# EAGLE design oc75 v5 (EAGLE 9.3.0)
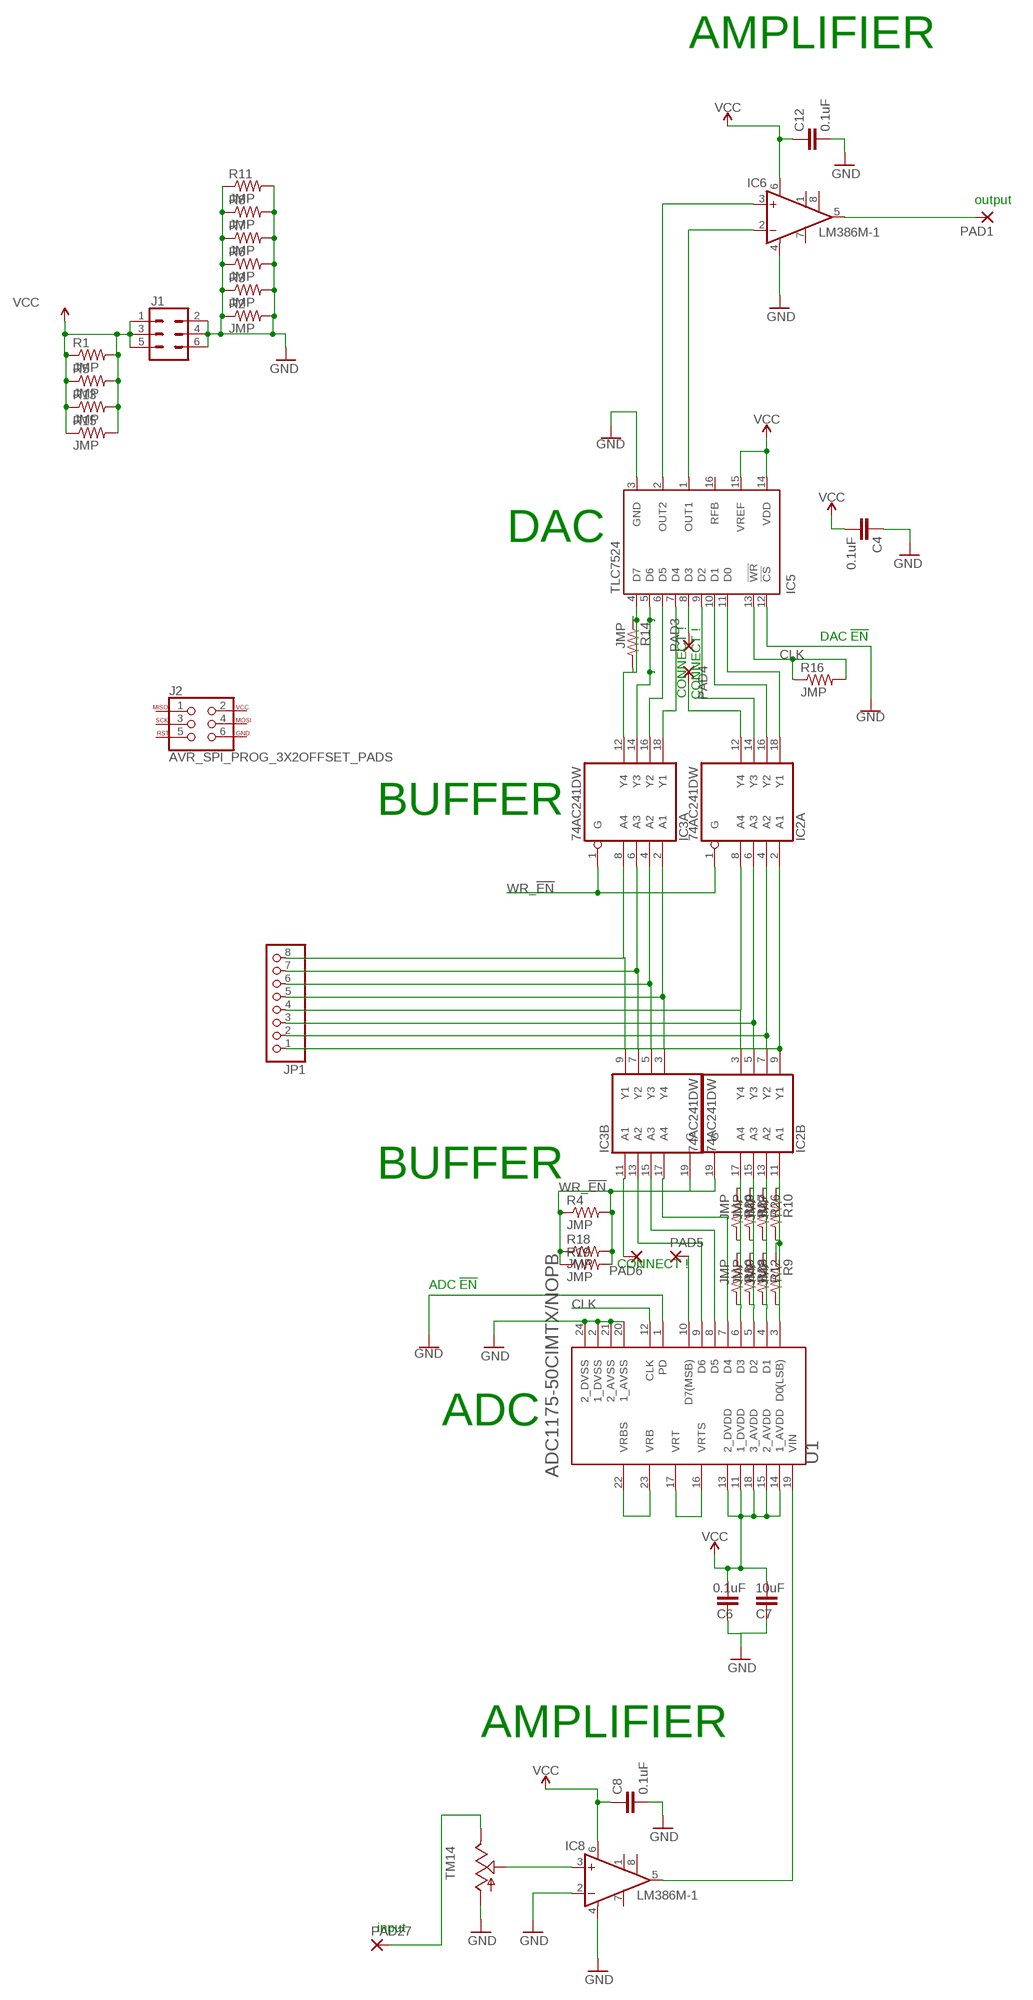
[diagram p0: schematic, sheet 1]

## Parts
C4  0.1uF  1.0UF-1206-50V-10%  [1206]
C6  0.1uF  1.0UF-1206-50V-10%  [1206]
C7  10uF  1.0UF-1206-50V-10%  [1206]
C8  0.1uF  1.0UF-1206-50V-10%  [1206]
C12  0.1uF  1.0UF-1206-50V-10%  [1206]
IC2  74AC241DW  [SO20W]
IC3  74AC241DW  [SO20W]
IC5  TLC7524  [SO16]
IC6  LM386M-1  [SO08]
IC8  LM386M-1  [SO08]
J1  CONN_03X2FEMALE_SMD  [2X3_SMD]
J2  AVR_SPI_PROG_3X2OFFSET_PADS  [2X3_OFFSET]
JP1  PINHD-1X8BIG  [1X08-BIG]
PAD1  SMD2  [SMD1,27-2,54]
PAD3  SMD2  [SMD1,27-2,54]
PAD4  SMD2  [SMD1,27-2,54]
PAD5  SMD2  [SMD1,27-2,54]
PAD6  SMD2  [SMD1,27-2,54]
PAD27  SMD2  [SMD1,27-2,54]
R1  JMP  R-US_M1206  [M1206]
R2  JMP  R-US_M1206  [M1206]
R3  JMP  R-US_M1206  [M1206]
R4  JMP  R-US_M1206  [M1206]
R5  JMP  R-US_M1206  [M1206]
R6  JMP  R-US_M1206  [M1206]
R7  JMP  R-US_M1206  [M1206]
R8  JMP  R-US_M1206  [M1206]
R9  JMP  R-US_M1206  [M1206]
R10  JMP  R-US_M1206  [M1206]
R11  JMP  R-US_M1206  [M1206]
R12  JMP  R-US_M1206  [M1206]
R13  JMP  R-US_M1206  [M1206]
R14  JMP  R-US_M1206  [M1206]
R15  JMP  R-US_M1206  [M1206]
R16  JMP  R-US_M1206  [M1206]
R18  JMP  R-US_M1206  [M1206]
R19  JMP  R-US_M1206  [M1206]
R26  JMP  R-US_M1206  [M1206]
R27  JMP  R-US_M1206  [M1206]
R28  JMP  R-US_M1206  [M1206]
R29  JMP  R-US_M1206  [M1206]
R30  JMP  R-US_M1206  [M1206]
TM14  TRIM  [6MM]
U1  TEXAS_INSTRUMENTS_ADC1175-50CIMTX-NOPBTEXAS_INSTRUMENTS_ADC1175-50CIMTX-NOPB_0_0  [TEXAS_INSTRUMENTS_ADC1175-50CIMTX-NOPB_0]

## Nets
CLK: IC5.13(!WR) R16.1 R16.2 U1.12(CLK)
GND: C4.1 C6.1 C7.1 C8.2 C12.2 IC5.3(GND) IC5.12(!CS) IC6.4(GND) IC8.2(-IN) IC8.4(GND) J1.2 J1.4 J1.6 R2.1 R2.2 R3.1 R3.2 R6.1 R6.2 R7.1 R7.2 R8.1 R8.2 R11.1 R11.2 TM14.A U1.1(PD) U1.2(1_DVSS) U1.20(1_AVSS) U1.21(2_AVSS) U1.24(2_DVSS)
N$14: IC2.2(A:A1) IC2.9(B:Y1) JP1.1
N$15: IC2.4(A:A2) IC2.7(B:Y2) JP1.2
N$16: IC2.5(B:Y3) IC2.6(A:A3) JP1.3
N$17: IC2.3(B:Y4) IC2.8(A:A4) JP1.4
N$18: IC3.2(A:A1) IC3.3(B:Y4) JP1.5
N$19: IC3.4(A:A2) IC3.5(B:Y3) JP1.6
N$20: IC3.6(A:A3) IC3.7(B:Y2) JP1.7
N$21: IC3.8(A:A4) IC3.9(B:Y1) JP1.8
N$22: IC2.18(A:Y1) IC5.11(D0)
N$23: IC2.16(A:Y2) IC5.10(D1)
N$24: IC2.14(A:Y3) IC5.9(D2)
N$25: IC2.12(A:Y4) PAD4.1(P)
N$26: IC3.18(A:Y1) IC5.7(D4)
N$27: IC3.16(A:Y2) IC5.6(D5)
N$28: IC3.14(A:Y3) IC5.5(D6)
N$29: IC3.12(A:Y4) IC5.4(D7) R14.1 R14.2
N$30: IC2.11(B:A1) R9.1 R9.2 R10.1 R10.2 U1.3(D0(LSB))
N$31: IC2.13(B:A2) R12.1 R12.2 R26.1 R26.2 U1.4(D1)
N$32: IC2.15(B:A3) R27.1 R27.2 R28.1 R28.2 U1.5(D2)
N$33: IC2.17(B:A4) R29.1 R29.2 R30.1 R30.2 U1.6(D3)
N$34: IC3.17(B:A4) U1.7(D4)
N$35: IC3.15(B:A3) U1.8(D5)
N$36: IC3.13(B:A2) U1.9(D6)
N$37: IC3.11(B:A1) PAD6.1(P)
N$38: IC5.8(D3) PAD3.1(P)
N$39: IC5.2(OUT2) IC6.3(+IN)
N$40: IC5.1(OUT1) IC6.2(-IN)
N$41: U1.16(VRTS) U1.17(VRT)
N$42: U1.22(VRBS) U1.23(VRB)
N$44: IC6.5(OUT) PAD1.1(P)
N$45: PAD5.1(P) U1.10(D7(MSB))
N$75: PAD27.1(P) TM14.E
N$99: IC8.3(+IN) TM14.S
N$100: IC8.5(OUT) U1.19(VIN)
VCC: C4.2 C6.2 C7.2 C8.1 C12.1 IC5.14(VDD) IC5.15(VREF) IC6.6(VS) IC8.6(VS) J1.1 J1.3 J1.5 R1.1 R1.2 R5.1 R5.2 R13.1 R13.2 R15.1 R15.2 U1.11(1_DVDD) U1.13(2_DVDD) U1.14(1_AVDD) U1.15(2_AVDD) U1.18(3_AVDD)
WR_!EN: IC2.1(A:G) IC2.19(B:G) IC3.1(A:G) IC3.19(B:G) R4.1 R4.2 R18.1 R18.2 R19.1 R19.2
Unconnected: IC5.16(RFB) IC6.1(GAIN) IC6.7(BYPASS) IC6.8(GAIN) IC8.1(GAIN) IC8.7(BYPASS) IC8.8(GAIN) J2.1 J2.2 J2.3 J2.4 J2.5 J2.6

## Notes on the sheet
- AMPLIFIER
- output
- DAC
- DAC !EN
- CONNECT ! | CONNECT !
- BUFFER
- BUFFER
- CONNECT !
- ADC !EN
- ADC
- AMPLIFIER
- input

## Power pins joined to a net without a drawn wire
GND: IC2.10(P:GND) IC3.10(P:GND)
VCC: IC2.20(P:VCC) IC3.20(P:VCC)

## Library data of the parts
C4 C6-C8 C12 = SparkFun-Capacitors:1.0UF: 1µF ceramic capacitors A capacitor is a passive two-terminal electrical component used to store electrical energy temporarily in an electric field.; PROD_ID: CAP-09822; VALUE: 1.0uF
IC2 IC3 = 74xx-eu:74*241: Octal BUFFER and LINE DRIVER, 3-state
IC5 = tlc7524:TLC7524: 8-Bit Buffered Multiplying DAC Source: http://www.analog.com/UploadedFiles/Data_Sheets/888358036ad7524.pdf
IC6 IC8 = linear:LM386?-*: Low Voltage Audio Power Amplifier Source: http://cache.national.com/ds/LM/LM386.pdf
J1 = SparkFun-Connectors:CONN_03X2: Multi connection point. Often used as Generic Header-pin footprint for 0.1 inch spaced/style header connections You can populate with any combo of single row headers, but if you'd like an exact match, check these: Header - 2x3 (Male, 0.1") <https://www.sparkfun.com/products/12807> (PRT-12807) Header - 2x3 (Female, 0.1") <https://www.sparkfun.com/products/13010> (PRT-13010) 2x3 Pin Shrouded Header <https://www.sparkfun.com/products/10877> (PRT-10877) On any of the 0.1 inch spaced packages, you can populate with these: Break Away Headers - Straight <https://www.sparkfun.com/products/116> (PRT-00116) Break Away Male Headers - Right Angle <https://www.sparkfun.com/products/553> (PRT-00553) Female Headers <https://www.sparkfun.com/products/115> (PRT-00115) Break Away Headers - Machine Pin <https://www.sparkfun.com/products/117> (PRT-00117) Break Away Female Headers - Swiss Machine Pin <https://www.sparkfun.com/products/743> (PRT-00743) Special note: the shrouded connector mates well with our 3x2 ribbon cables: Ribbon Crimp Connector - 6-pin (2x3, Female) <https://www.sparkfun.com/products/10651> (PRT-10651) Ribbon Cable - 6 wire (15ft) <https://www.sparkfun.com/products/10646> (PRT-10646); PROD_ID: CONN-11290
J2 = SparkFun-Connectors:AVR_SPI_PROG_3X2: AVR ISP 6 Pin This is the reduced ISP connector for AVR programming. Common on Arduino. This footprint will take up less PCB space and can be used with a 10-pin to 6-pin adapter such as SKU: BOB-08508 **Special note about "TEST_POINT" package. The stop mask is on the top side, so if you want your programming test points to be on the bottom of your board, make sure to place this package on the bottom side of the board. This also ensure that the orientation to program from the bottom side will be correct. SparkFun Products: SparkFun ISP Pogo Adapter <https://www.sparkfun.com/products/11591> - NS Tiny AVR Programmer <https://www.sparkfun.com/products/11801> -PTH
JP1 = adafruit:PINHD-1X8: PIN HEADER
PAD1 PAD3-PAD6 PAD27 = wirepad:SMD2: SMD PAD
R1-R16 R18 R19 R26-R30 = adafruit:R-US_: RESISTOR, American symbol
TM14 = adafruit:TRIM
U1 = NOPB:TEXAS_INSTRUMENTS_ADC1175-50CIMTX-NOPB: IC ADC 8BIT 24-TSSOP; CENTROID_NOT_SPECIFIED: No; DATASHEET: http://www.ti.com/lit/ds/symlink/adc1175-50.pdf; DIGIKEY_DESCRIPTION: IC ADC 8BIT 24-TSSOP; DIGIKEY_PART_NUMBER: 296-36905-1-ND; IPC_LAND_PATTERN_NAME: CAPC6030X23; LEAD_FREE: yes; MF: Texas Instruments; MFG_PACKAGE_IDENT: PW0024A; MFG_PACKAGE_IDENT_DATE: 0; MFG_PACKAGE_IDENT_REV: 0; MOUSER_DESCRIPTION: Analog to Digital Converters - ADC; MOUSER_PART_NUMBER: 926-AD117550CIMTXNPB; MPN: ADC1175-50CIMTX/NOPB; PACKAGE: TSSOP-24; PREFIX: U; ROHS: yes; TEMPERATURE_RANGE_HIGH: +75°C; TEMPERATURE_RANGE_LOW: -20°C

## Board
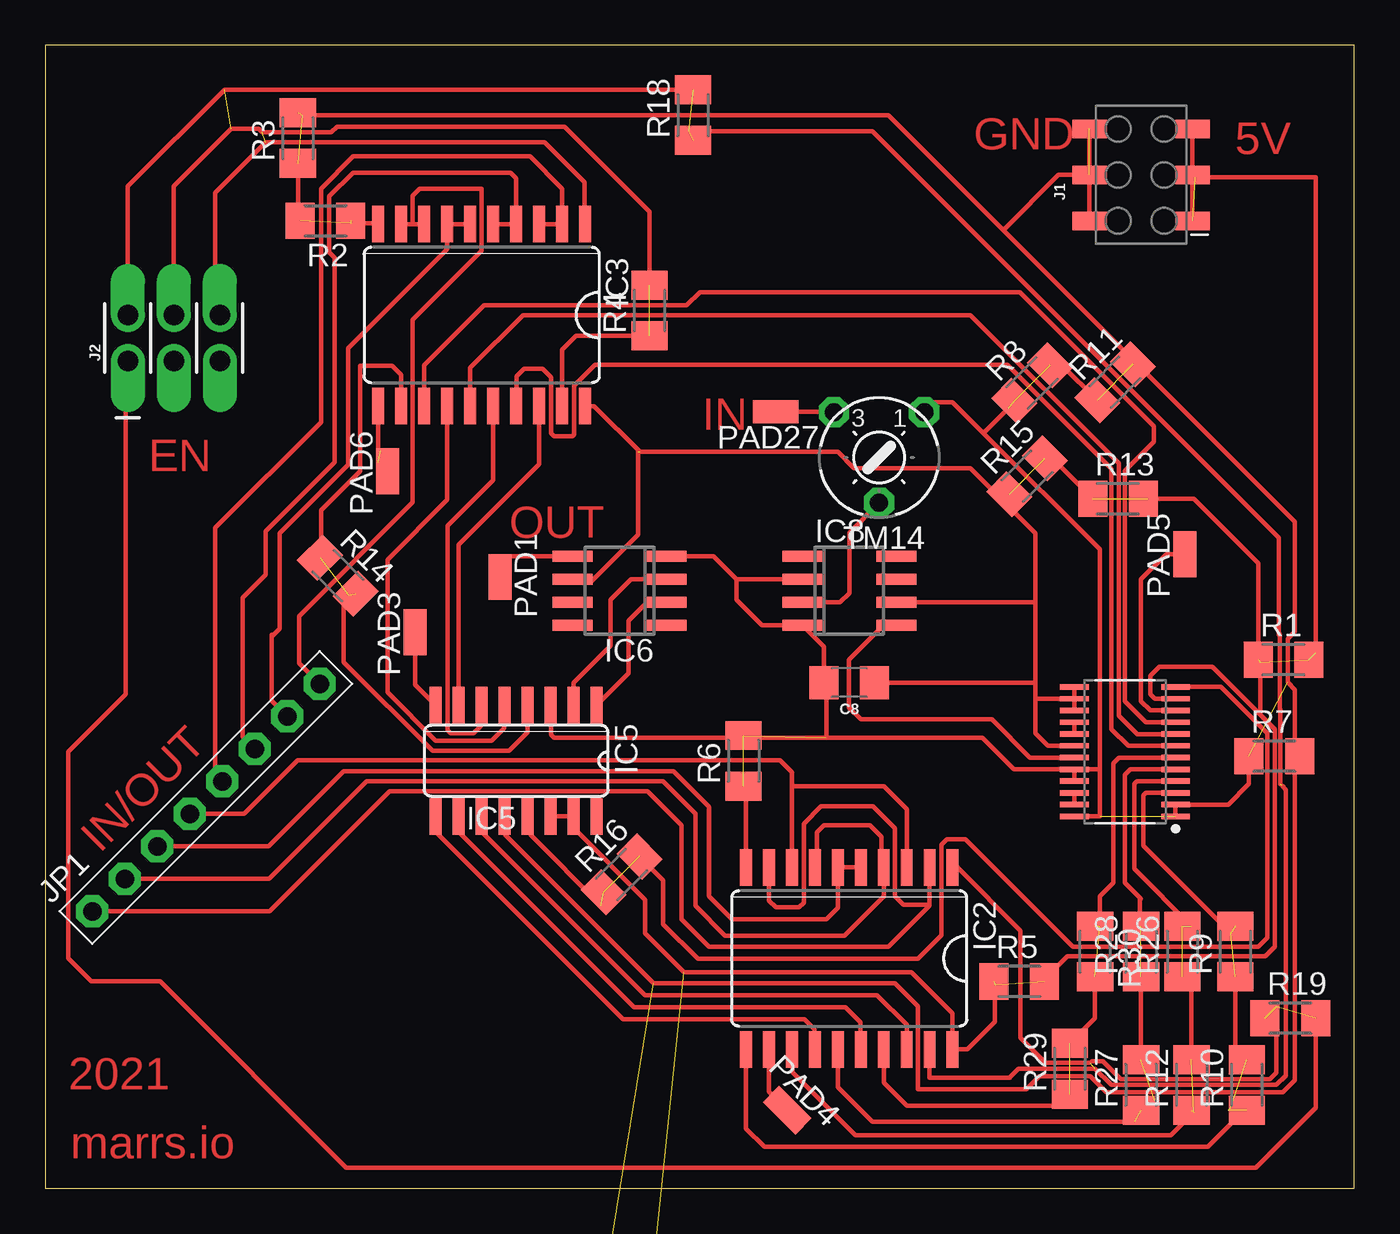
[diagram p1: board, top side]
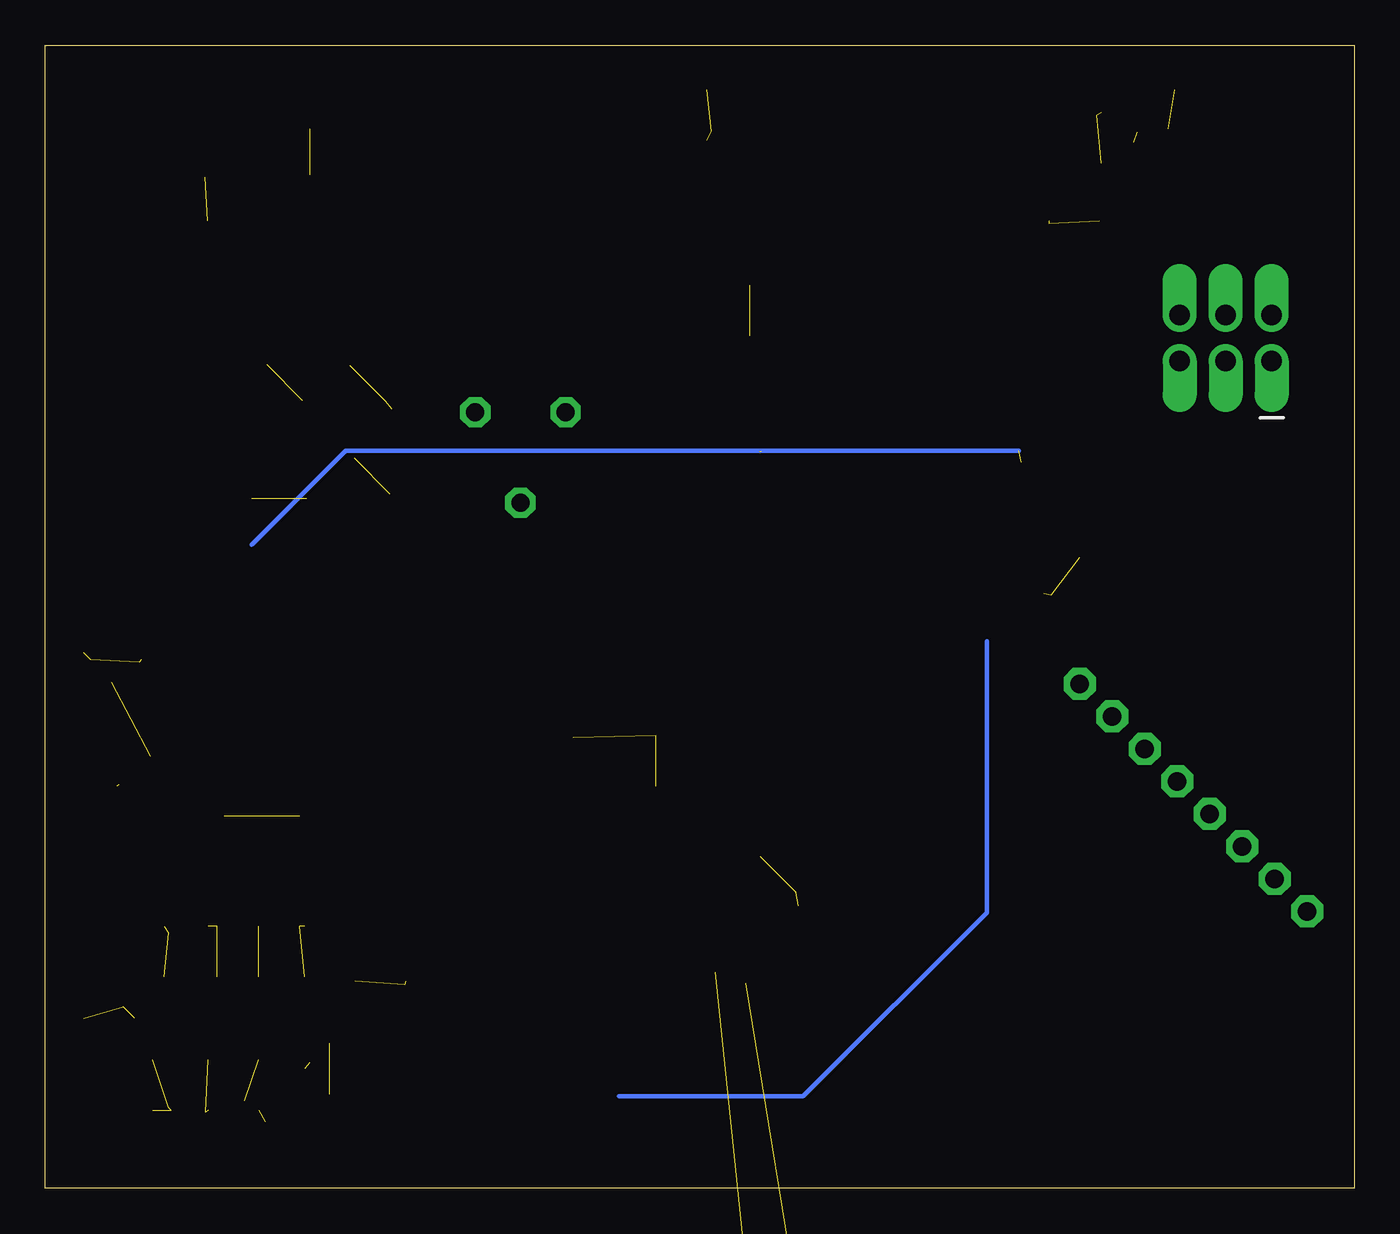
[diagram p2: board, bottom side, seen from below]

Size 72.37 x 63.17 mm. Coordinates in mm from the lower left corner, seen from the top.
Outline: 0,0 72.37,0 72.37,63.17 0,63.17 0,0
Copper layers (1*16): Top 0.035mm / dielectric 1.5mm / Bottom 0.035mm
Design rules "default *": minimum track width 10mil, minimum drill 0.35mm, track to track 6mil, track to pad 6mil, pad to pad 6mil, via to via 6mil, smd to smd 6mil, copper to edge 40mil, drill to drill 6mil, minimum pad ring 10mil, minimum via ring 8mil, stop-mask expansion 4mil, vias tented up to drill 0mil, thermal gap 10mil

### Footprints (pad centres in the part's own frame; a part is rotated, then mirrored left to right if it is on the bottom)
1206 = smd 1.6 x 1.8: 1 -1.4,0; 2 1.4,0
SO20W = smd 0.66 x 2.032: 1 -5.715,-5.029; 2 -4.445,-5.029; 3 -3.175,-5.029; 4 -1.905,-5.029; 5 -0.635,-5.029; 6 0.635,-5.029; 7 1.905,-5.029; 8 3.175,-5.029; 9 4.445,-5.029; 10 5.715,-5.029; 11 5.715,5.029; 12 4.445,5.029; 13 3.175,5.029; 14 1.905,5.029; 15 0.635,5.029; 16 -0.635,5.029; 17 -1.905,5.029; 18 -3.175,5.029; 19 -4.445,5.029; 20 -5.715,5.029
SO16 = smd 0.66 x 2.032: 1 -4.445,-3.073; 2 -3.175,-3.073; 3 -1.905,-3.073; 4 -0.635,-3.073; 5 0.635,-3.073; 6 1.905,-3.073; 7 3.175,-3.073; 8 4.445,-3.073; 9 4.445,3.073; 10 3.175,3.073; 11 1.905,3.073; 12 0.635,3.073; 13 -0.635,3.073; 14 -1.905,3.073; 15 -3.175,3.073; 16 -4.445,3.073
SO08 = smd 0.6 x 2.2: 1 -1.905,-2.6; 2 -0.635,-2.6; 3 0.635,-2.6; 4 1.905,-2.6; 5 1.905,2.6; 6 0.635,2.6; 7 -0.635,2.6; 8 -1.905,2.6
2X3_SMD = smd 1.02 x 1.9: 1 -2.54,-2.85; 2 -2.54,2.85; 3 0,-2.85; 4 0,2.85; 5 2.54,-2.85; 6 2.54,2.85
2X3_OFFSET = drill 1.118 pad 1.88 offset: 1 -2.54,-1.27; 2 -2.54,1.27; 3 0,-1.27; 4 0,1.27; 5 2.54,-1.27; 6 2.54,1.27
1X08-BIG = drill 1.016 pad 1.778 octagon: 1 -8.89,0; 2 -6.35,0; 3 -3.81,0; 4 -1.27,0; 5 1.27,0; 6 3.81,0; 7 6.35,0; 8 8.89,0
SMD1,27-2,54 = smd 1.27 x 2.54: 1 0,0
M1206 = smd 1.6 x 2: 1 -1.4,0; 2 1.4,0
6MM = drill 1 pad 1.676 octagon: A -2.5,-2.5; E 2.5,-2.5; S 0,2.5
TEXAS_INSTRUMENTS_ADC1175-50CIMTX-NOPB_0 = smd 0.3 x 1.6: 1 -3.575,-2.8; 2 -2.925,-2.8; 3 -2.275,-2.8; 4 -1.625,-2.8; 5 -0.975,-2.8; 6 -0.325,-2.8; 7 0.325,-2.8; 8 0.975,-2.8; 9 1.625,-2.8; 10 2.275,-2.8; 11 2.925,-2.8; 12 3.575,-2.8; 13 3.575,2.8; 14 2.925,2.8; 15 2.275,2.8; 16 1.625,2.8; 17 0.975,2.8; 18 0.325,2.8; 19 -0.325,2.8; 20 -0.975,2.8; 21 -1.625,2.8; 22 -2.275,2.8; 23 -2.925,2.8; 24 -3.575,2.8 | smd 0.25 x 1.55: SMD_25 3.575,2.8; SMD_26 2.925,2.8; SMD_27 2.275,2.8; SMD_28 1.625,2.8; SMD_29 0.975,2.8; SMD_30 0.325,2.8; SMD_31 -0.325,2.8; SMD_32 -0.975,2.8; SMD_33 -1.625,2.8; SMD_34 -2.275,2.8; SMD_35 -2.925,2.8; SMD_36 -3.575,2.8; SMD_37 -3.575,-2.8; SMD_38 -2.925,-2.8; SMD_39 -2.275,-2.8; SMD_40 -1.625,-2.8; SMD_41 -0.975,-2.8; SMD_42 -0.325,-2.8; SMD_43 0.325,-2.8; SMD_44 0.975,-2.8; SMD_45 1.625,-2.8; SMD_46 2.275,-2.8; SMD_47 2.925,-2.8; SMD_48 3.575,-2.8

### Placement (x,y rotation side)
C4  -48.26,-50.8 0 top  (outside the outline)
C6  31.75,-8.89 0 top  (outside the outline)
C7  -2.54,-24.13 0 top  (outside the outline)
C8  44.45,27.94 180 top
C12  -35.56,-58.42 0 top  (outside the outline)
IC2  44.45,12.7 180 top
IC3  24.13,48.26 180 top
IC5  26.04,23.62 180 top
IC6  31.75,33.02 90 top
IC8  44.45,33.02 270 top
J1  60.58,56.01 90 top
J2  7.11,46.99 0 top
JP1  8.89,21.59 45 top
PAD1  25.15,33.78 180 top
PAD3  20.45,30.73 0 top
PAD4  41.02,4.32 225 top
PAD5  62.99,35.05 0 top
PAD6  18.92,39.62 0 top
PAD27  40.39,42.93 90 top
R1  68.45,29.21 0 top
R2  15.49,53.47 180 top
R3  13.97,58.04 90 top
R4  33.4,48.51 90 top
R5  53.85,11.43 0 top
R6  38.61,23.62 90 top
R7  67.94,23.88 0 top
R8  54.56,44.5 45 top
R9  65.79,13.08 90 top
R10  66.42,5.71 90 top
R11  59.14,44.54 45 top
R12  63.37,5.71 90 top
R13  59.31,38.1 0 top
R14  16.18,33.85 315 top
R15  54.28,39.35 45 top
R16  31.86,17.35 45 top
R18  35.81,59.31 90 top
R19  68.83,9.4 0 top
R26  62.86,13.08 90 top
R27  60.58,5.71 90 top
R28  60.58,13.08 90 top
R29  56.64,6.6 90 top
R30  58.04,13.08 270 top
TM14  46.1,40.39 180 top
U1  59.69,24.13 90 top

### Tracks (layer width: path | path; a pad name or v marks a point on that pad's centre or on a via)
CLK  (2 unrouted)
  Top 0.254: U1.12 65,27.71 67.56,25.15 67.56,13.84 67.06,13.34 56.81,13.34 50.86,19.28 49.85,19.28 49.55,18.99 49.55,13.99 48.23,12.67 36.09,12.67 34.16,14.6 34.16,17.02 R16.2 | 30.73,15.62 26.82,19.53 26.82,20.4 IC5.13
GND  (16 unrouted)
  Top 0.254: IC2.10 38.73,21.46 38.61,21.59 R6.1 | U1.21 U1.20 | U1.1 U1.2 65.4,21.2 66.55,22.35 R7.1 | IC5.3 27.96,26.67 27.96,25.06 28.13,24.89 43.18,24.89 | U1.24 58.29,20.55 58.29,23.16 | U1.20 58.29,23.16 | 43.18,24.89 51.82,24.89 53.55,23.16 U1.20 | IC5.12 25.43,20.52 25.43,19.54 33.64,11.33 46.98,11.33 48.23,10.07 48.23,5.46 54.23,5.46 54.97,6.2 57.78,6.2 58.67,5.31 68.43,5.31 69.09,5.97 69.09,27.56 68.69,27.96 68.69,30.37 69.09,30.77 69.09,36.83 52.96,52.96 | IC3.10 18.36,53.34 16.89,53.34 | IC6.4 36.96,34.93 38.23,33.65 | 38.23,33.65 IC8.2 | 43.18,24.89 43.18,27.81 C8.2 43.05,29.91 IC8.4 39.62,31.12 38.23,32.51 38.23,33.65 | 58.29,23.16 58.29,35.31 51.88,41.72 | 51.88,41.72 50.16,43.43 49.15,43.43 TM14.A | 52.96,52.96 46.61,59.31 14.22,59.31 | 51.88,41.72 53.23,43.07 | J1.2 J1.6 | J1.4 56.01,56.01 52.96,52.96 | R2.2 13.97,53.59 R3.1 | R7.2 68.69,23.88 | R11.1 56.21,45.49 R8.2
N$14
  Top 0.254: IC2.9 40,15.9 40.39,15.52 41.68,15.52 41.94,15.77 41.94,20.16 42.88,21.11 45.76,21.11 46.96,19.9 46.96,16.14 47.43,15.67 48.87,15.67 48.87,16.81 48.89,16.84 IC2.2 48.89,15.62 46.61,13.34 36.7,13.34 35.18,14.86 35.18,20.07 33.29,21.95 19.05,21.95 12.4,15.3 JP1.1
N$15
  Top 0.254: IC2.7 42.67,17.86 42.67,19.68 43.05,20.07 45.59,20.07 46.23,19.43 46.23,17.86 IC2.4 46.35,16.13 44.2,13.97 37.59,13.97 35.94,15.62 35.94,20.7 34.14,22.5 17.78,22.5 12.38,17.1 JP1.2
N$16
  Top 0.254: IC2.5 IC2.6 43.81,15.49 43.18,14.86 37.97,14.86 36.7,16.13 36.7,21.08 34.73,23.05 16.51,23.05 12.36,18.9 JP1.3
N$17
  Top 0.254: 41.27,22.23 41.27,22.99 40.62,23.64 13.94,23.64 10.99,20.69 JP1.4 | 41.27,22.23 IC2.8 | IC2.3 47.62,20.95 46.35,22.23 41.27,22.23
N$18
  Top 0.254: IC3.3 IC3.2 28.57,55.24 26.8,57.02 17.02,57.02 15.24,55.24 15.24,42.34 9.4,36.5 9.4,22.88 JP1.5
N$19
  Top 0.254: IC3.5 IC3.4 26.04,55.83 25.73,56.13 17.02,56.13 15.7,54.82 15.7,51.73 16,51.43 16,40.13 12.19,36.32 12.19,33.91 10.92,32.64 10.92,24.95 JP1.6
N$20
  Top 0.254: IC3.6 IC3.7 22.22,51.91 16.74,46.42 16.74,39.98 12.95,36.2 12.95,30.93 12.51,30.48 | JP1.7 12.51,26.95 12.51,30.48 | 12.51,30.48 12.51,30.6
N$21
  Top 0.254: IC3.8 20.32,53.29 | 20.32,53.29 IC3.9 | 20.32,53.29 20.32,54.86 20.7,55.24 24.13,55.24 24.13,51.82 20.32,48.01 20.32,38.1 20.32,37.97 20.32,37.91 14.03,31.62 14.03,29.02 JP1.8
N$22
  Top 0.254: IC5.11 24.15,20.52 24.15,19.67 33.16,10.67 45.99,10.67 47.62,9.03 IC2.18
N$23
  Top 0.254: IC5.10 22.76,20.45 22.76,19.8 32.55,10.01 44.24,10.01 45.06,9.18 45.06,7.7 IC2.16
N$24
  Top 0.254: IC5.9 21.61,20.52 21.61,19.67 31.94,9.35 41.97,9.35 42.52,8.8 42.52,7.7 IC2.14
N$25
  Top 0.254: IC2.12 40,5.33 PAD4.1
N$26
  Top 0.254: IC5.7 22.86,35.56 27.3,40.01 IC3.18
N$27
  Top 0.254: IC5.6 24.11,26.67 24.11,25.56 23.69,25.15 22.41,25.15 22.25,25.31 22.25,36.6 24.76,39.12 IC3.16
N$28
  Top 0.254: IC3.14 22.22,38.05 18.92,34.74 18.92,27.41 21.59,24.74 24.68,24.74 25.37,25.44 25.37,26.67 IC5.5
N$29  (2 unrouted)
  Top 0.254: 19.68,42.8 IC3.12 19.68,44.96 19.18,45.47 17.4,45.47 17.4,39.62 15.24,37.46 15.24,34.9 R14.1 | IC5.4 26.67,25.21 25.64,24.18 21.42,24.18 16.51,29.08 16.51,32.51 16.76,32.77
N$30  (5 unrouted)
  Top 0.254: IC2.11 38.73,3.3 39.75,2.29 64.26,2.29 66.42,4.45 R10.1 | U1.3 60.84,21.85 60.71,21.72 60.71,18.92 65.53,14.1 | R9.1 65.79,7.75 R10.2
N$31  (4 unrouted)
  Top 0.254: IC2.13 41.27,7.04 41.3,7.01 41.3,6.41 44.79,2.92 62.23,2.92 63.5,4.19 | U1.4 60.35,22.5 60.2,22.35 60.2,17.65 63.37,14.48 | R26.1 63.37,11.17 R12.2
N$32  (3 unrouted)
  Top 0.254: IC2.15 43.81,5.59 45.72,3.68 60.2,3.68 61.34,4.83 | U1.5 59.98,23.16 59.69,22.86 59.69,16.89 60.52,16.07 | 60.52,16.07 60.58,16 | R28.1 R27.2 | 60.52,16.07 60.52,14.55 R28.2
N$33  (3 unrouted)
  Top 0.254: IC2.17 46.35,5.84 47.62,4.57 56.01,4.57 | U1.6 59.36,23.8 59.05,23.49 59.05,16.89 58.29,16.13 58.29,14.48 | 56.01,4.57 56.77,4.57 56.52,4.83 | R30.2 58.04,9.4 R29.2 | R29.1 56.01,4.57
N$34
  Top 0.254: IC3.17 26.06,43.26 26.06,44.87 26.48,45.29 27.5,45.29 27.96,44.82 27.96,41.72 28.13,41.55 29.15,41.55 29.24,41.64 29.24,44.36 30.38,45.51 53.2,45.51 58.95,39.76 58.95,25.38 59.87,24.45 U1.7
N$35
  Top 0.254: U1.8 60.37,25.1 59.36,26.11 59.36,40.06 51.16,48.26 26.42,48.26 23.5,45.34 IC3.15
N$36
  Top 0.254: U1.9 60.86,25.75 59.69,26.92 59.69,39.65 61.29,41.24 61.29,42.11 53.87,49.53 36.19,49.53 35.46,48.79 24.26,48.79 20.96,45.49 IC3.13
N$37  (1 unrouted)
  Top 0.254: PAD6.1 18.42,40.13 IC3.11
  Bottom 0.254: 18.54,40.77 55.75,40.77 60.96,35.56
N$38
  Top 0.254: IC5.8 20.45,27.84 PAD3.1
N$39
  Top 0.254: IC5.2 29.21,27.94 31.24,29.97 31.24,32.51 32.39,33.65 IC6.3
N$40
  Top 0.254: IC5.1 32.26,28.47 32.26,31.37 33.27,32.38 IC6.2
N$41
  Top 0.254: U1.16 U1.17
N$42
  Top 0.254: U1.23 U1.22
N$43
  Bottom 0.254: 20.32,30.23 20.32,17.78 20.32,17.14 20.32,15.24 30.48,5.08 40.64,5.08
N$44
  Top 0.254: PAD1.1 25.15,34.93 IC6.5
N$45
  Top 0.254: U1.10 62.48,26.42 61.09,26.42 60.58,26.92 60.58,33.65 61.98,35.05 PAD5.1
N$75
  Top 0.254: TM14.E 43.56,42.93 PAD27.1
N$99
  Top 0.254: TM14.S 44.45,36.23 44.45,32.89 43.94,32.38 IC8.3
N$100
  Top 0.254: U1.19 54.43,23.8 52.32,25.91 45.08,25.91 44.42,26.57 44.42,29.21 46.33,31.12 IC8.5
VCC  (14 unrouted)
  Top 0.254: U1.13 U1.14 | U1.14 U1.15 | U1.18 55.43,24.45 54.74,25.15 54.74,27.05 | 54.74,32.38 54.74,36.2 53.09,37.85 | 54.74,32.38 54.74,27.94 | 54.74,27.94 54.74,27.05 | U1.14 54.74,27.05 | IC5.14 IC5.15 29.21,19.91 33.17,15.95 33.17,14.08 35.32,11.94 47.89,11.94 50.16,9.67 IC2.20 50.98,7.67 52.52,9.21 52.52,11.24 | 53.09,37.85 51.14,39.8 44.7,39.8 43.81,40.69 32.89,40.69 30.35,43.23 IC3.20 | U1.11 61.34,27.05 61.09,27.3 61.09,28.32 61.59,28.83 64.52,28.83 67.18,26.16 | 67.18,26.16 67.97,25.38 67.97,13.36 67.44,12.83 56.52,12.83 55.25,11.56 R5.2 | IC6.6 29.35,33.46 30.11,33.46 32.77,36.11 32.77,40.69 | 54.74,27.94 C8.1 52.64,27.94 | 48.19,32.38 IC8.6 54.74,32.38 | 67.18,29.08 67.18,26.16 | 70.23,29.59 70.23,55.88 63.56,55.88 J1.3 | J1.5 J1.1 | R1.1 67.05,34.55 63.5,38.1 60.96,38.1 | R13.1 55.67,40.34 R15.2 | R15.1 53.29,38.05 53.09,37.85
WR_!EN  (9 unrouted)
  Top 0.254: 50.16,17.14 IC2.1 50.42,17.73 53.92,14.22 53.92,8.31 55.3,6.92 57.76,6.92 57.86,7.03 58.47,7.03 59.46,6.04 67.71,6.04 68.07,6.39 68.07,10.03 | 29.9,53.34 IC3.1 29.82,53.32 29.82,55.59 27.6,57.81 12.19,57.81 9.4,55.02 9.4,48.88 | IC3.19 28.57,46.35 29.33,47.11 R4.1 | IC2.19 48.89,6.1 53.34,6.1 53.34,6.15 53.8,6.6 58.04,6.6 58.93,5.71 68.07,5.71 68.58,6.22 68.58,22.03 68.38,22.23 | 68.28,22.33 68.28,26.46 68.24,26.5 68.24,30.62 68.2,30.58 68.2,35.94 45.72,58.42 35.56,58.42 | R4.2 32.77,50.55 | 33.02,50.29 R4.2 | R18.2 9.91,60.71 4.57,55.37 4.57,49.02 | R19.2 70.23,4.45 66.93,1.14 16.64,1.14 6.35,11.43 2.54,11.43 1.27,12.7 1.27,24.13 4.44,27.3 4.44,45.59 | R4.2 33.4,53.98 28.7,58.67 16.13,58.67 15.82,58.36 12,58.36 11.81,58.55 10.29,58.55 7.11,55.37 7.11,49.02

### Text on the board
Top: oc75 | video sampler | GND | 5V | rev.1 | IN | EN | OUT | IN/OUT | 2021 | marrs.io